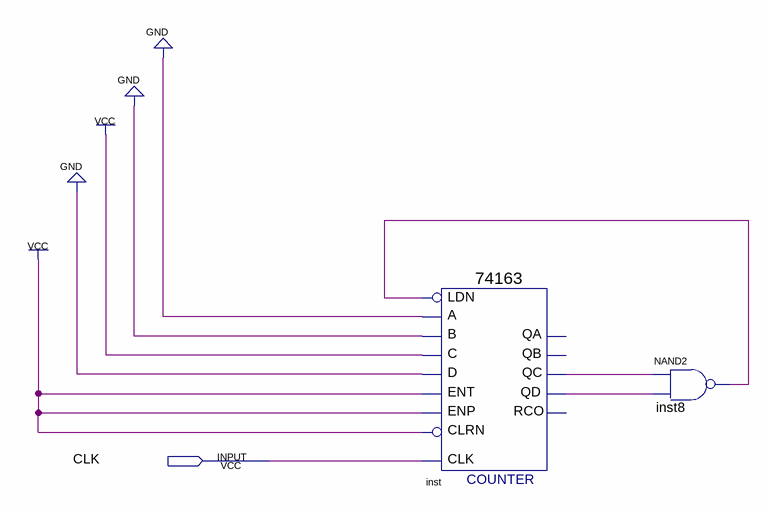
[diagram p0: schematic sheet]
// Quartus schematic SpecialCount4_12.bdf as structural Verilog: 2 symbols, 1 pins
module SpecialCount4_12 (
  input  CLK
);

  wire inst8_out, inst_qc, inst_qd;

  \74163  inst (
    .C(1'b1), .B(1'b0), .A(1'b0), .ENT(1'b1), .D(1'b0), .CLRN(1'b1), .CLK(CLK), .ENP(1'b1), .LDN(inst8_out),
    .QC(inst_qc), .QD(inst_qd));  // open: QA, QB, RCO
  nand inst8 (inst8_out, inst_qc, inst_qd);
endmodule
